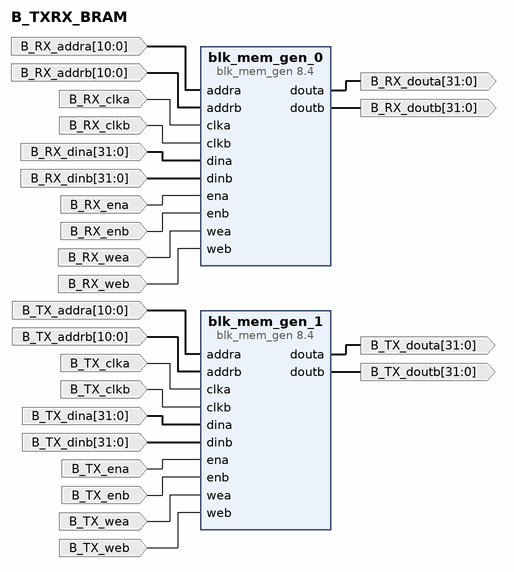
[diagram p0: block diagram of the top level]
# Vivado block design B_TXRX_BRAM, xcku5p-ffvb676-2-e, Vivado 2022.1
create_bd_design B_TXRX_BRAM

create_bd_port -dir I -from 10 -to 0 -type data B_TX_addra
create_bd_port -dir I -type clk B_TX_clka
set_property -dict {CONFIG.FREQ_HZ 125000000} [get_bd_ports B_TX_clka]
create_bd_port -dir O -from 31 -to 0 B_TX_douta
create_bd_port -dir I B_TX_ena
create_bd_port -dir I B_TX_wea
create_bd_port -dir I -from 10 -to 0 -type data B_TX_addrb
create_bd_port -dir I -type clk B_TX_clkb
set_property -dict {CONFIG.FREQ_HZ 125000000} [get_bd_ports B_TX_clkb]
create_bd_port -dir I -from 31 -to 0 -type data B_TX_dinb
create_bd_port -dir O -from 31 -to 0 -type data B_TX_doutb
create_bd_port -dir I B_TX_enb
create_bd_port -dir I B_TX_web
create_bd_port -dir I -from 10 -to 0 -type data B_RX_addra
create_bd_port -dir I -type clk B_RX_clka
set_property -dict {CONFIG.FREQ_HZ 125000000} [get_bd_ports B_RX_clka]
create_bd_port -dir I -from 31 -to 0 -type data B_RX_dina
create_bd_port -dir O -from 31 -to 0 -type data B_RX_douta
create_bd_port -dir I B_RX_ena
create_bd_port -dir I B_RX_wea
create_bd_port -dir I -from 10 -to 0 -type data B_RX_addrb
create_bd_port -dir I -type clk B_RX_clkb
set_property -dict {CONFIG.FREQ_HZ 125000000} [get_bd_ports B_RX_clkb]
create_bd_port -dir I -from 31 -to 0 -type data B_RX_dinb
create_bd_port -dir O -from 31 -to 0 B_RX_doutb
create_bd_port -dir I B_RX_enb
create_bd_port -dir I B_RX_web
create_bd_port -dir I -from 31 -to 0 -type data B_TX_dina

create_bd_cell -type ip -vlnv xilinx.com:ip:blk_mem_gen:8.4 blk_mem_gen_0
set_property -dict [list \
  CONFIG.Enable_32bit_Address false \
  CONFIG.Enable_B Use_ENB_Pin \
  CONFIG.Memory_Type True_Dual_Port_RAM \
  CONFIG.Port_B_Clock 100 \
  CONFIG.Port_B_Enable_Rate 100 \
  CONFIG.Port_B_Write_Rate 50 \
  CONFIG.Register_PortA_Output_of_Memory_Primitives true \
  CONFIG.Register_PortB_Output_of_Memory_Primitives true \
  CONFIG.Use_Byte_Write_Enable false \
  CONFIG.Use_RSTA_Pin false \
  CONFIG.Write_Depth_A 2048 \
  CONFIG.use_bram_block Stand_Alone \
] [get_bd_cells blk_mem_gen_0]
create_bd_cell -type ip -vlnv xilinx.com:ip:blk_mem_gen:8.4 blk_mem_gen_1
set_property -dict [list \
  CONFIG.Enable_32bit_Address false \
  CONFIG.Enable_B Use_ENB_Pin \
  CONFIG.Memory_Type True_Dual_Port_RAM \
  CONFIG.Port_B_Clock 100 \
  CONFIG.Port_B_Enable_Rate 100 \
  CONFIG.Port_B_Write_Rate 50 \
  CONFIG.Register_PortA_Output_of_Memory_Primitives true \
  CONFIG.Register_PortB_Output_of_Memory_Primitives true \
  CONFIG.Use_Byte_Write_Enable false \
  CONFIG.Use_RSTA_Pin false \
  CONFIG.Write_Depth_A 2048 \
  CONFIG.use_bram_block Stand_Alone \
] [get_bd_cells blk_mem_gen_1]

# ---- connections ----

connect_bd_net [get_bd_ports B_RX_addra] [get_bd_pins blk_mem_gen_0/addra]
connect_bd_net [get_bd_ports B_RX_addrb] [get_bd_pins blk_mem_gen_0/addrb]
connect_bd_net [get_bd_ports B_RX_clka] [get_bd_pins blk_mem_gen_0/clka]
connect_bd_net [get_bd_ports B_RX_clkb] [get_bd_pins blk_mem_gen_0/clkb]
connect_bd_net [get_bd_ports B_RX_dina] [get_bd_pins blk_mem_gen_0/dina]
connect_bd_net [get_bd_ports B_RX_dinb] [get_bd_pins blk_mem_gen_0/dinb]
connect_bd_net [get_bd_ports B_RX_ena] [get_bd_pins blk_mem_gen_0/ena]
connect_bd_net [get_bd_ports B_RX_enb] [get_bd_pins blk_mem_gen_0/enb]
connect_bd_net [get_bd_ports B_RX_wea] [get_bd_pins blk_mem_gen_0/wea]
connect_bd_net [get_bd_ports B_RX_web] [get_bd_pins blk_mem_gen_0/web]
connect_bd_net [get_bd_ports B_TX_addra] [get_bd_pins blk_mem_gen_1/addra]
connect_bd_net [get_bd_ports B_TX_addrb] [get_bd_pins blk_mem_gen_1/addrb]
connect_bd_net [get_bd_ports B_TX_clka] [get_bd_pins blk_mem_gen_1/clka]
connect_bd_net [get_bd_ports B_TX_clkb] [get_bd_pins blk_mem_gen_1/clkb]
connect_bd_net [get_bd_ports B_TX_dina] [get_bd_pins blk_mem_gen_1/dina]
connect_bd_net [get_bd_ports B_TX_dinb] [get_bd_pins blk_mem_gen_1/dinb]
connect_bd_net [get_bd_ports B_TX_ena] [get_bd_pins blk_mem_gen_1/ena]
connect_bd_net [get_bd_ports B_TX_enb] [get_bd_pins blk_mem_gen_1/enb]
connect_bd_net [get_bd_ports B_TX_wea] [get_bd_pins blk_mem_gen_1/wea]
connect_bd_net [get_bd_ports B_TX_web] [get_bd_pins blk_mem_gen_1/web]
connect_bd_net [get_bd_pins blk_mem_gen_0/douta] [get_bd_ports B_RX_douta]
connect_bd_net [get_bd_pins blk_mem_gen_0/doutb] [get_bd_ports B_RX_doutb]
connect_bd_net [get_bd_pins blk_mem_gen_1/douta] [get_bd_ports B_TX_douta]
connect_bd_net [get_bd_pins blk_mem_gen_1/doutb] [get_bd_ports B_TX_doutb]

validate_bd_design
save_bd_design
